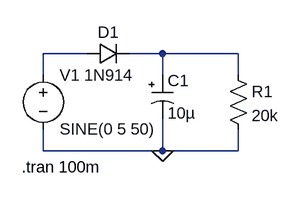
[diagram p0: schematic 1_2.asc]
1_2.asc, the LTspice schematic file:
Version 4
SHEET 1 880 680
WIRE 80 48 16 48
WIRE 192 48 144 48
WIRE 304 48 192 48
WIRE 16 80 16 48
WIRE 192 80 192 48
WIRE 304 80 304 48
WIRE 16 192 16 160
WIRE 192 192 192 144
WIRE 192 192 16 192
WIRE 304 192 304 160
WIRE 304 192 192 192
FLAG 192 192 0
SYMBOL diode 80 64 R270
WINDOW 0 32 32 VTop 2
WINDOW 3 0 32 VBottom 2
SYMATTR InstName D1
SYMATTR Value 1N914
SYMBOL voltage 16 64 R0
WINDOW 123 0 0 Left 2
WINDOW 39 0 0 Left 2
SYMATTR InstName V1
SYMATTR Value SINE(0 5 50)
SYMBOL polcap 176 80 R0
WINDOW 3 24 56 Left 2
SYMATTR Value 10µ
SYMATTR InstName C1
SYMATTR Description Capacitor
SYMATTR Type cap
SYMATTR SpiceLine V=10 Irms=2.21565 Rser=0.055 Lser=0 mfg="KEMET" pn="A700V106M010ATE055" type="Al electrolytic"
SYMBOL res 288 64 R0
SYMATTR InstName R1
SYMATTR Value 20k
TEXT -16 216 Left 2 !.tran 100m

The netlist it stands for:
* 1_2.asc
D1 N001 N002 1N914
V1 N001 0 SINE(0 5 50)
C1 N002 0 10µ V=10 Irms=2.21565 Rser=0.055 Lser=0 mfg="KEMET" pn="A700V106M010ATE055" type="Al electrolytic"
R1 N002 0 20k
.model D D
.lib standard.dio
.tran 100m
.backanno
.end